# EAGLE schematic avionicsboard (EAGLE 9.6.2)
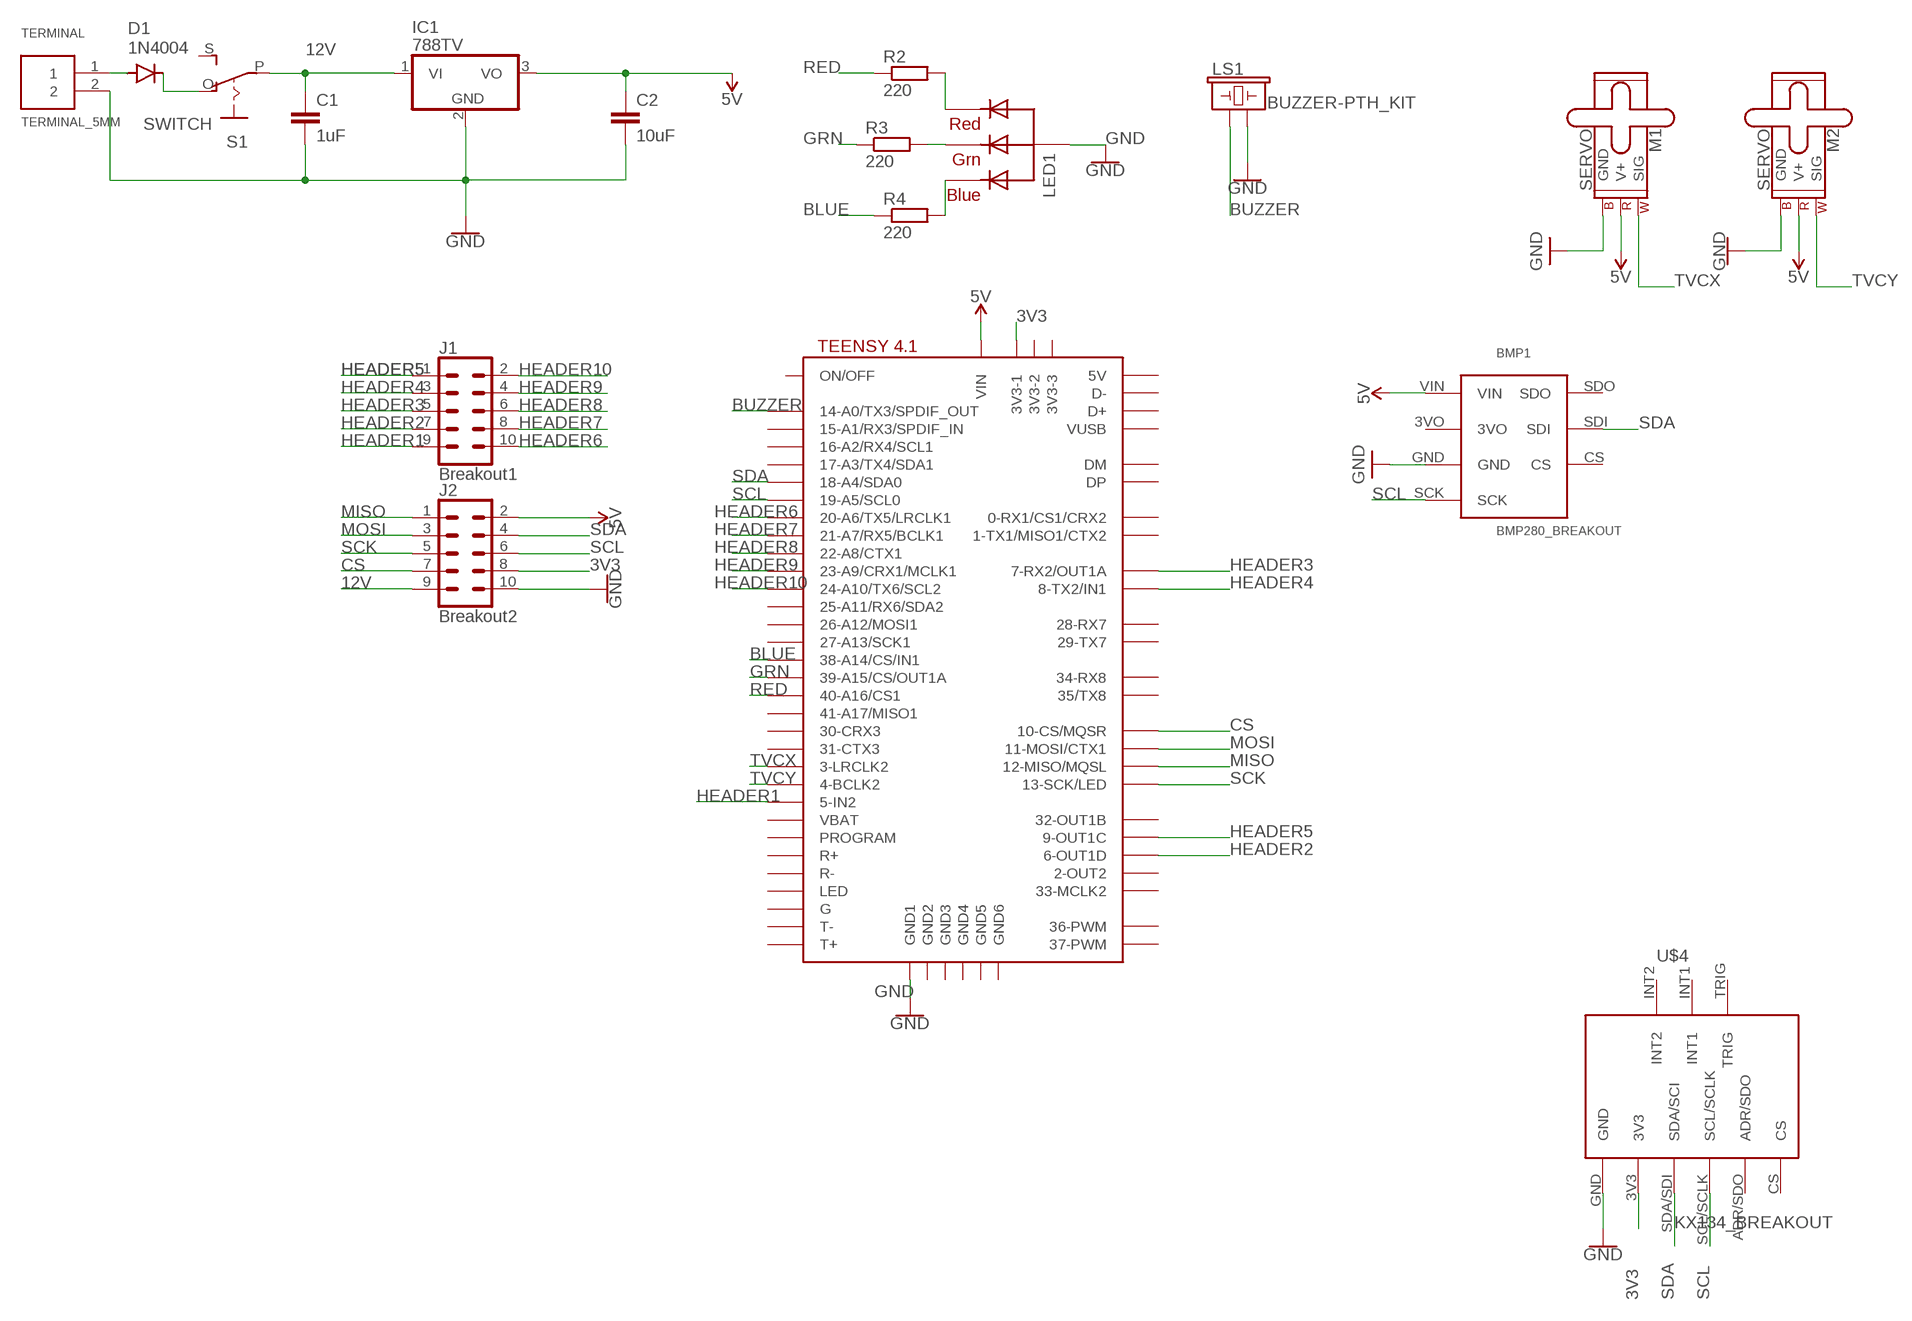
[diagram p0: schematic, sheet 1]

## Parts
BMP1  BMP280_BREAKOUT  [BMP280_BREAKOUT]
C1  1uF  22PF-PTH-2.54MM-200V-5%  [CAP-PTH-2.54]
C2  10uF  22PF-PTH-2.54MM-200V-5%  [CAP-PTH-2.54]
D1  1N4004  [DO41-10]
IC1  788TV  [TO220V]
J1  Breakout1  CONN_05X2NO_SILK  [2X5_NOSILK]
J2  Breakout2  CONN_05X2NO_SILK  [2X5_NOSILK]
LED1  RGBLED_CA-5MM  [LED5MMRGB]
LS1  BUZZER-PTH_KIT  [BUZZER-12MM-KIT]
M1  SERVO  [1X03]
M2  SERVO  [1X03]
R2  220  R-EU_0204/7  [0204/7]
R3  220  R-EU_0204/7  [0204/7]
R4  220  R-EU_0204/7  [0204/7]
S1  SWITCH  EG1218S  [EG1218]
TERMINAL  TERMINAL_5MM  [TERMINAL_5MM]
U$1  TEENSY41  [TEENSY41]
U$4  KX134_BREAKOUT  [KX134_BREAKOUT]

## Nets
3V3: J2.8 U$1.3V3-1 U$4.3V3
5V: BMP1.VIN C2.1 IC1.3(VO) J2.2 M1.2(V+) M2.2(V+) U$1.VIN
12V: C1.1 IC1.1(VI) J2.9 S1.P
BLUE: R4.1 U$1.38-A14/CS/IN1
BUZZER: LS1.+ U$1.14-A0/TX3/SPDIF_OUT
CS: J2.7 U$1.10-CS\MQSR(10-CS/MQSR)
GND: BMP1.GND C1.2 C2.2 IC1.2(GND) J2.10 LED1.2(VCC) LS1.- M1.3(GND) M2.3(GND) TERMINAL.2 U$1.GND1 U$4.GND
GRN: R3.1 U$1.39-A15/CS/OUT1A
HEADER1: J1.9 U$1.5-IN2
HEADER2: J1.7 U$1.6-OUT1D
HEADER3: J1.5 U$1.7-RX2/OUT1A
HEADER4: J1.3 U$1.8-TX2/IN2(8-TX2/IN1)
HEADER5: J1.1 U$1.9-OUT1C
HEADER6: J1.10 U$1.20-A6/TX5/LRCLK1
HEADER7: J1.8 U$1.21-A7/RX5/BCLK1
HEADER8: J1.6 U$1.22-A8/CTX1
HEADER9: J1.4 U$1.23-A9/CRX1/MCLK1
HEADER10: J1.2 U$1.24-A10/TX6/SCL2
MISO: J2.1 U$1.12-MISO/MQSL
MOSI: J2.3 U$1.11-MOSI/CTX1
N$2: LED1.1(RED) R2.2
N$3: LED1.3(GREEN) R3.2
N$4: LED1.4(BLUE) R4.2
N$5: D1.A TERMINAL.1
N$6: D1.C S1.O
RED: R2.1 U$1.40-A16/CS1
SCK: J2.5 U$1.13-SCK/LED
SCL: BMP1.SCK J2.6 U$1.19-A5/SCL0 U$4.SCL/SCLK
SDA: BMP1.SDI J2.4 U$1.18-A4/SDA0 U$4.SDA/SDI(SDA/SCI)
TVCX: M1.1(SIG) U$1.3-LRCLK2
TVCY: M2.1(SIG) U$1.4-BCLK2
Unconnected: BMP1.3VO BMP1.CS BMP1.SDO S1.S U$1.0-RX1/CS1/CRX2 U$1.1-TX1/MISO1/CTX2 U$1.2-OUT2 U$1.3V3-2 U$1.3V3-3 U$1.15-A1/RX3/SPDIF_IN U$1.16-A2/RX4/SCL1 U$1.17-A3/TX4/SDA1 U$1.25-A11/RX6/SDA2 U$1.26-A12/MOSI1 U$1.27-A13/SCK1 U$1.28-RX7 U$1.29-TX7 U$1.30-CRX3 U$1.31-CTX3 U$1.32-OUT1B U$1.33-MCLK2 U$1.34-RX8 U$1.35-TX8(35/TX8) U$1.36-PWM U$1.37-PWM U$1.41-A17/MISO1 U$1.+5V(5V) U$1.D+ U$1.D- U$1.DM U$1.DP U$1.G U$1.GND2 U$1.GND3 U$1.GND4 U$1.GND5 U$1.GND6 U$1.LED U$1.ON/OFF U$1.PROGRAM U$1.R+ U$1.R- U$1.T+ U$1.T- U$1.VBAT U$1.VUSB U$4.ADR/SDO U$4.CS U$4.INT1 U$4.INT2 U$4.TRIG

## Library data of the parts
BMP1 = BMP280_BREAKOUT:BMP280_BREAKOUT: BMP280 Breakout Board From AdaFruit https://github.com/adafruit/Adafruit-BMP280-Breakout-PCB
C1 C2 = SparkFun-Capacitors:22PF: 22pF ceramic capacitors A capacitor is a passive two-terminal electrical component used to store electrical energy temporarily in an electric field.; PROD_ID: CAP-09128; VALUE: 22pF
D1 = diode:1N4004: DIODE general purpose rectifier, 1 A
IC1 = linear:78*: Positive VOLTAGE REGULATOR Source: http://cache.national.com/ds/LM/LM78L05.pdf http://www.fairchildsemi.com/ds/LM/LM7805.pdf
J1 J2 = SparkFun-Connectors:CONN_05X2: Multi connection point. Often used as Generic Header-pin footprint for 0.1 inch spaced/style header connections For AVR SPI programming port, see special device with nice symbol: "AVR_SPI_PROG_5x2.dev" You can populate with any combo of single row headers, but if you'd like an exact match, check these: 2x5 AVR ICSP Male Header <https://www.sparkfun.com/products/778> (PRT-00778) 2x5 Pin Shrouded Header <https://www.sparkfun.com/products/8506> (PRT-08506) On any of the 0.1 inch spaced packages, you can populate with these: Break Away Headers - Straight <https://www.sparkfun.com/products/116> (PRT-00116) Break Away Male Headers - Right Angle <https://www.sparkfun.com/products/553> (PRT-00553) Female Headers <https://www.sparkfun.com/products/115> (PRT-00115) Break Away Headers - Machine Pin <https://www.sparkfun.com/products/117> (PRT-00117) Break Away Female Headers - Swiss Machine Pin <https://www.sparkfun.com/products/743> (PRT-00743) Special note: the shrouded connector mates well with our 5x2 ribbon cables: 2x5 Pin IDC Ribbon Cable <https://www.sparkfun.com/products/8535> (PRT-08535)
LED1 = adafruit:RGBLED_CA: RGB LED, common-anode 5MM Staggered pins 5mm Piranha package http://www.ladyada.net/library/pcb/eaglelibrary.html
LS1 = SparkFun-Electromechanical:BUZZER: Buzzer Small round buzzers that operate around the audible 2kHz range. You can use these as speakers to create simple music or user interfaces. Variant Overview: PTH - Mini Speaker - PC Mount 12mm 2.048kHz <https://www.sparkfun.com/products/7950> PTH_KIT - Mini Speaker - PC Mount 12mm 2.048kHz <https://www.sparkfun.com/products/7950> KIT simplifies soldering by adding stop mask to one side of the pads. PTH_NO_SILK - Mini Speaker - PC Mount 12mm 2.048kHz <https://www.sparkfun.com/products/7950> No silkscreen indicator of buzzer outline. PTH_KIT_NO_SILK - Mini Speaker - PC Mount 12mm 2.048kHz <https://www.sparkfun.com/products/7950> KIT package w/o silkscreen SMD - Buzzer Audio Magnetic (CCV-084B16) SMD buzzer used on, e.g. the LilyPad Buzzer <https://www.sparkfun.com/products/8463> and RFID USB Reader <https://www.sparkfun.com/products/9963>. SMD_KIT - Buzzer Audio Magnetic (CCV-084B16) SMD Buzzer with elongated pins to make soldering easier. Used on the SparkFun Simon Says - Surface Mount Soldering Kit <https://www.sparkfun.com/products/10935>. SMD-SQUARE - Buzzer Audio Magnetic (COMP-15701) SMT square buzzer with one chamfered corner.; PROD_ID: COMP-08253; SF_SKU: COM-07950
M1 M2 = SparkFun-Electromechanical:SERVO: Servo Motor 3-pin connector for a standard servo motor (voltage supply, ground, and control signal.) SparkFun Products Servo - Generic (Sub-Micro Size) <https://www.sparkfun.com/products/9065> (ROB-09065) Servo - Generic High Torque Continuous Rotation (Standard Size) <https://www.sparkfun.com/products/9347> (ROB-09347) Servo - Generic High Torque (Standard Size) <https://www.sparkfun.com/products/11965> (ROB-11965)
R2-R4 = rcl:R-EU_: RESISTOR, European symbol; SPICEPREFIX: R
S1 = adafruit:EG1218: SLIDING SWITCH 0.1" spacing through hole, vertical SPDT slide switch http://www.ladyada.net/library/pcb/eaglelibrary.html
TERMINAL = TERMINAL_5MM:TERMINAL_5MM
U$1 = teensy:TEENSY41
U$4 = KX134_BREAKOUT:KX134_BREAKOUT: KX134 Breakout Board From SparkFun https://www.sparkfun.com/products/17589